# Altium schematic sheet ESIMA E-Meter_CPU.SchDoc: Esima CPU
size A3; DrawnBy: Jürgen Merz; Address1: Wilhelm- Schickard- Strasse 10; Address2: 78052 Villingen Schwenningen; Address3: juergen.merz@hsg-imit.de; Address4: Tel. +49 7721 943 138; PhoneNumber: +49 7721 943 138; FaxNumber: +49 7721 943 140
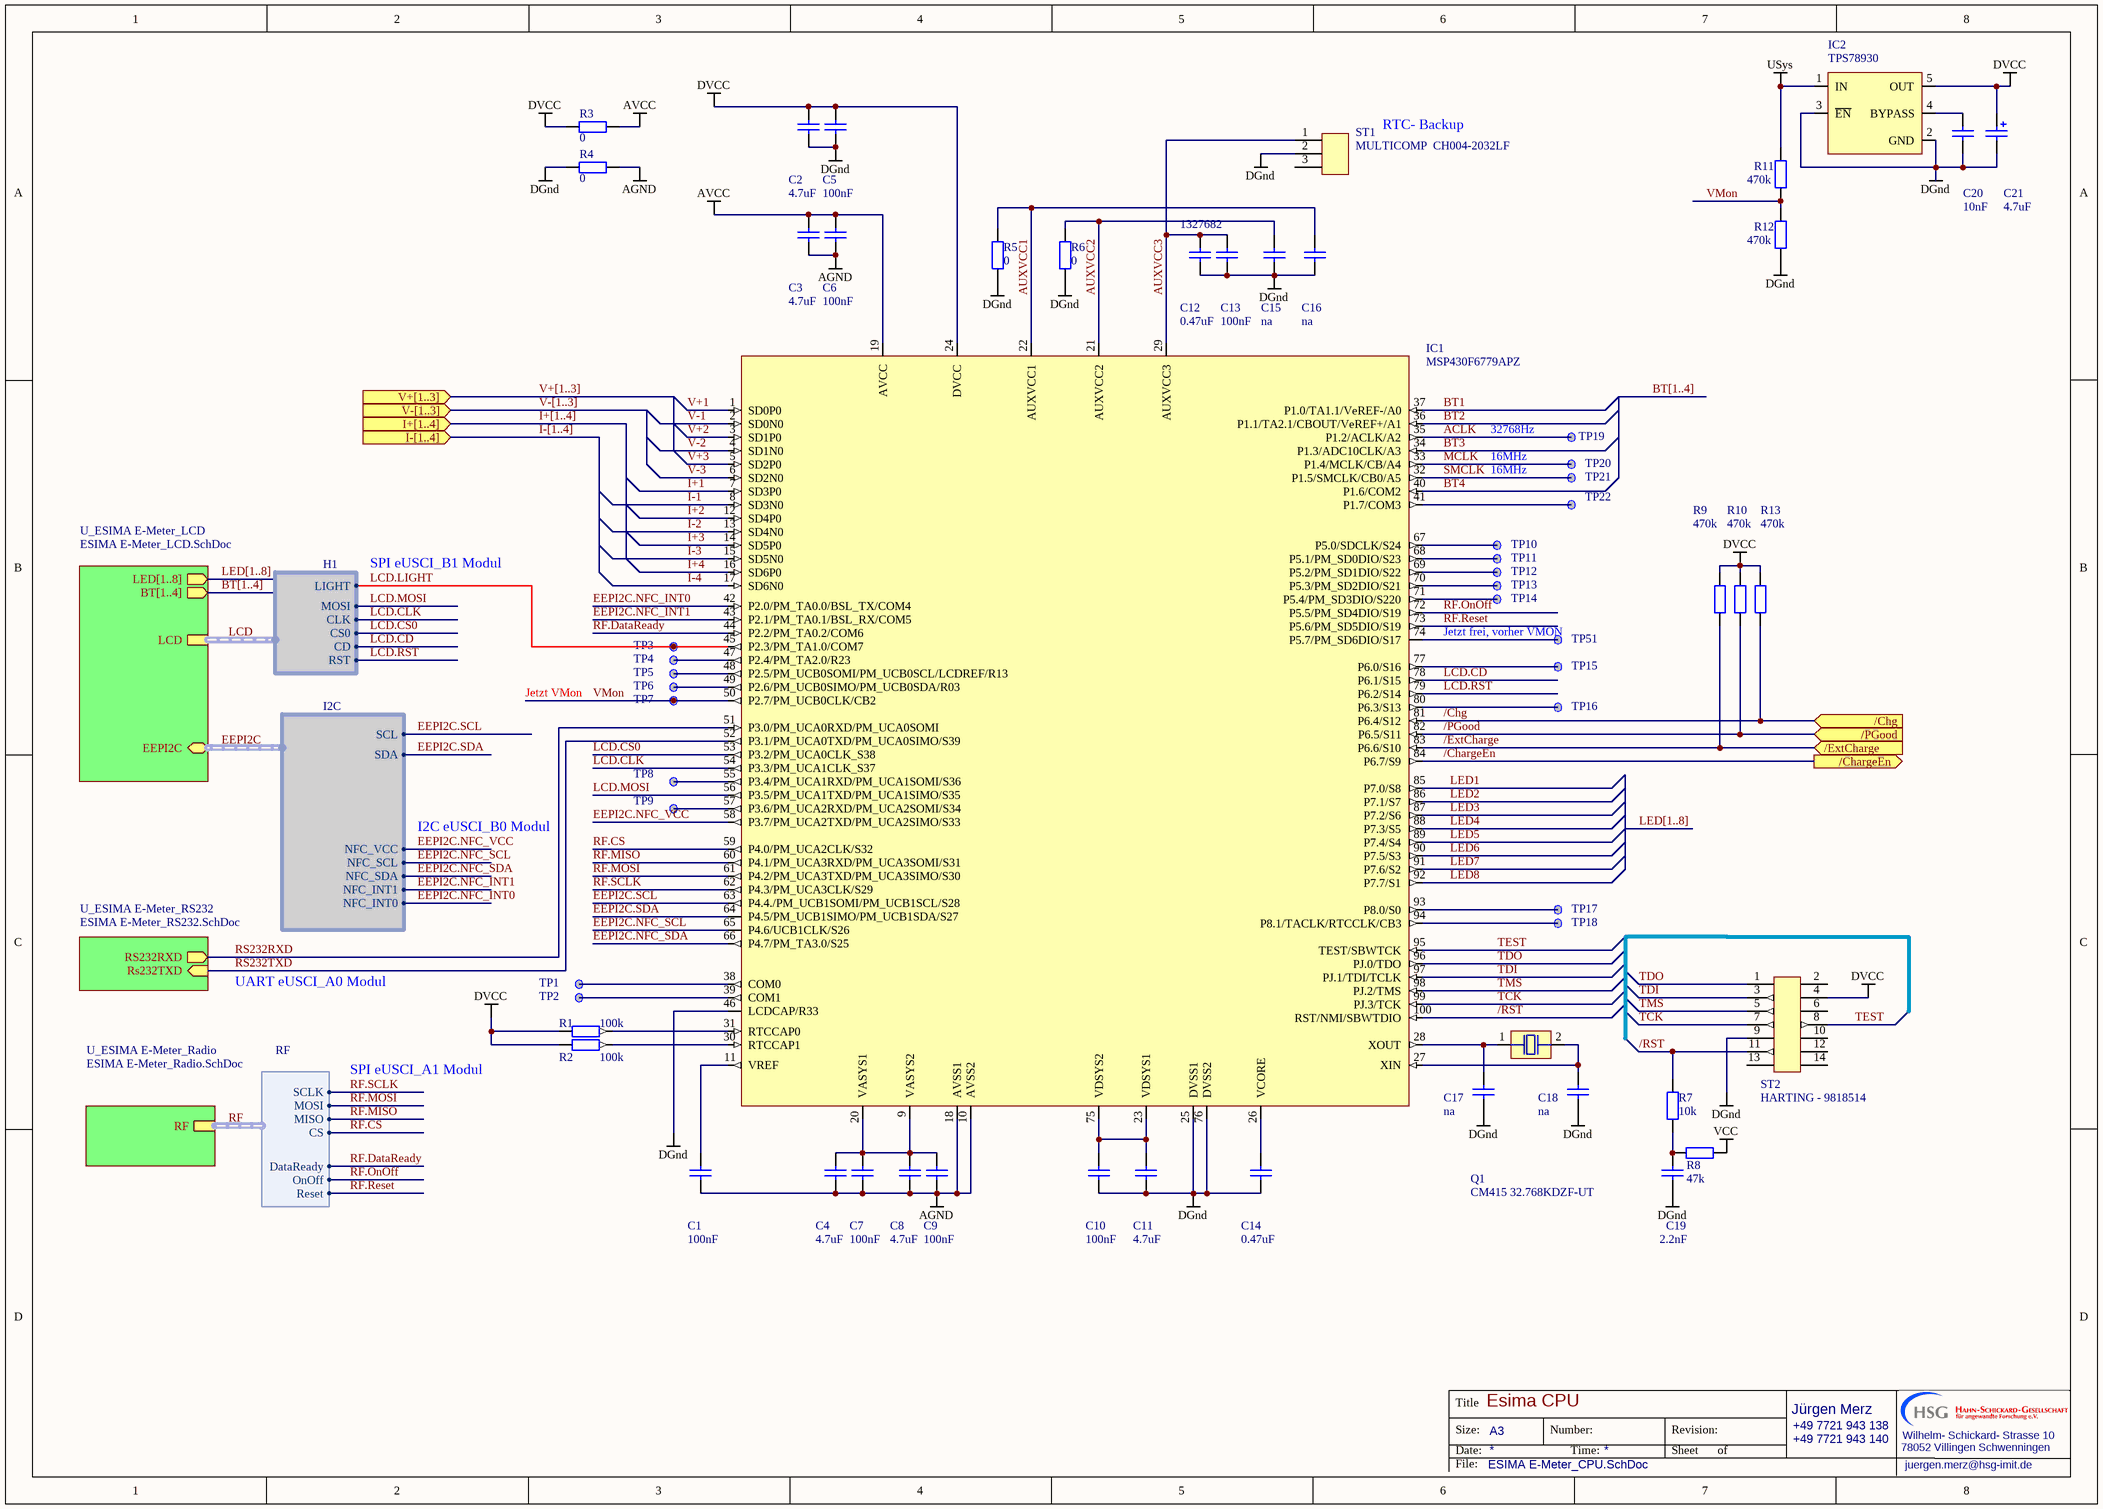
[diagram p0: ESIMA E-Meter_CPU.SchDoc]

## Parts
C1  100nF  [CAPC1608N]
C2  4.7uF  [CAPC1608N]
C3  4.7uF  [CAPC1608N]
C4  4.7uF  [CAPC1608N]
C5  100nF  [CAPC1608N]
C6  100nF  [CAPC1608N]
C7  100nF  [CAPC1608N]
C8  4.7uF  [CAPC1608N]
C9  100nF  [CAPC1608N]
C10  100nF  [CAPC1608N]
C11  4.7uF  [CAPC1608N]
C12  0.47uF  Supplier Part Number 1: 1327682  [CAPC1608N]
C13  100nF  [CAPC1608N]
C14  0.47uF  [CAPC1608N]
C15  na  [CAPC1608N]
C16  na  [CAPC1608N]
C17  na  [CAPC1608N]
C18  na  [CAPC1608N]
C19  2.2nF  [CAPC1608N]
C20  10nF  [CAPC1608N]
C21  4.7uF  [Cap Tant Pol Form B]
IC1  MSP430F6779APZ  [TI-PZ100_N]
IC2  TPS78930  [TI-DBV5 (SOT23-5)]
Q1  CM415 32.768KDZF-UT  [Quarz 2 Pin 4.1mm * 1.5mm]
R1  100k  [RESC1608N]
R2  100k  [RESC1608N]
R3  0  [RESC2012N]
R4  0  [RESC2012N]
R5  0  [RESC1608N]
R6  0  [RESC1608N]
R7  10k  [RESC1608N]
R8  47k  [RESC1608N]
R9  470k  [RESC1608N]
R10  470k  [RESC1608N]
R11  470k  [RESC1608N]
R12  470k  [RESC1608N]
R13  470k  [RESC1608N]
ST1  MULTICOMP  CH004-2032LF  [MULTICOMP  CH004-2032LF]
ST2  HARTING - 9818514  [HARTING -09 18 514 7324]
TP1  Testpoint 1mm  [Testpoint 1mm]  (value not drawn)  (no BOM)
TP2  Testpoint 1mm  [Testpoint 1mm]  (value not drawn)  (no BOM)
TP3  Testpoint 1mm  [Testpoint 1mm]  (value not drawn)  (no BOM)
TP4  Testpoint 1mm  [Testpoint 1mm]  (value not drawn)  (no BOM)
TP5  Testpoint 1mm  [Testpoint 1mm]  (value not drawn)  (no BOM)
TP6  Testpoint 1mm  [Testpoint 1mm]  (value not drawn)  (no BOM)
TP7  Testpoint 1mm  [Testpoint 1mm]  (value not drawn)  (no BOM)
TP8  Testpoint 1mm  [Testpoint 1mm]  (value not drawn)  (no BOM)
TP9  Testpoint 1mm  [Testpoint 1mm]  (value not drawn)  (no BOM)
TP10  Testpoint 1mm  [Testpoint 1mm]  (value not drawn)  (no BOM)
TP11  Testpoint 1mm  [Testpoint 1mm]  (value not drawn)  (no BOM)
TP12  Testpoint 1mm  [Testpoint 1mm]  (value not drawn)  (no BOM)
TP13  Testpoint 1mm  [Testpoint 1mm]  (value not drawn)  (no BOM)
TP14  Testpoint 1mm  [Testpoint 1mm]  (value not drawn)  (no BOM)
TP15  Testpoint 1mm  [Testpoint 1mm]  (value not drawn)  (no BOM)
TP16  Testpoint 1mm  [Testpoint 1mm]  (value not drawn)  (no BOM)
TP17  Testpoint 1mm  [Testpoint 1mm]  (value not drawn)  (no BOM)
TP18  Testpoint 1mm  [Testpoint 1mm]  (value not drawn)  (no BOM)
TP19  Testpoint 1mm  [Testpoint 1mm]  (value not drawn)  (no BOM)
TP20  Testpoint 1mm  [Testpoint 1mm]  (value not drawn)  (no BOM)
TP21  Testpoint 1mm  [Testpoint 1mm]  (value not drawn)  (no BOM)
TP22  Testpoint 1mm  [Testpoint 1mm]  (value not drawn)  (no BOM)
TP51  Testpoint 1mm  [Testpoint 1mm]  (value not drawn)  (no BOM)

## Sub-sheets
U_ESIMA E-Meter_LCD = ESIMA E-Meter_LCD.SchDoc: LED[1..8] (out), BT[1..4] (out, harness H_LCD), LCD (harness H1), EEPI2C (harness I2C)
U_ESIMA E-Meter_Radio = ESIMA E-Meter_Radio.SchDoc: RF (harness RF)
U_ESIMA E-Meter_RS232 = ESIMA E-Meter_RS232.SchDoc: Rs232TXD (in), RS232RXD (out)

## Ports
/ChargeEn (out), /Chg (in), /ExtCharge (in), /PGood (in), I+[1..4] (in), I-[1..4] (in), V+[1..3] (in), V-[1..3] (in)

## Harnesses
RF: SCLK, MOSI, MISO, CS, DataReady, OnOff, Reset
I2C: SCL, SDA, NFC_INT1, NFC_INT0, NFC_VCC, NFC_SCL, NFC_SDA
H1: CS0, MOSI, CLK, CD, RST, LIGHT

## Nets
AGND: C1.1 C3.1 C4.1 C6.1 C7.1 C8.1 C9.1 IC1.10(AVSS2) IC1.18(AVSS1) R4.1
AVCC: C3.2 C6.2 IC1.19(AVCC) R3.1
DGnd: C2.1 C5.1 C10.1 C11.1 C12.1 C13.1 C14.1 C15.1 C16.1 C17.1 C18.1 C19.1 C20.1 C21.2 IC1.25(DVSS1) IC1.46(LCDCAP/R33) IC1.76(DVSS2) IC2.2(GND) IC2.3(~{EN}) R4.2 R5.1 R6.1 R12.1 ST1.2 ST2.9
DVCC: C2.2 C5.2 C21.1 IC1.24(DVCC) IC2.5(OUT) R1.2 R2.2 R3.2 R9.1 R10.1 R13.1 ST2.4
USys: IC2.1(IN) R11.2
VCC: R8.1
/ChargeEn: IC1.84(P6.7/S9) ; port /ChargeEn
/Chg: IC1.81(P6.4/S12) R13.2 ; port /Chg
/ExtCharge: IC1.83(P6.6/S10) R9.2 ; port /ExtCharge
/PGood: IC1.82(P6.5/S11) R10.2 ; port /PGood
/RST: IC1.100(RST/NMI/SBWTDIO) R7.1 ST2.11
ACLK: IC1.35(P1.2/ACLK/A2) TP19.1
AUXVCC1: C16.2 IC1.22(AUXVCC1) R5.2
AUXVCC2: C15.2 IC1.21(AUXVCC2) R6.2
AUXVCC3: C12.2 C13.2 IC1.29(AUXVCC3) ST1.1
BT1: IC1.37(P1.0/TA1.1/VeREF-/A0)
BT2: IC1.36(P1.1/TA2.1/CBOUT/VeREF+/A1)
BT3: IC1.34(P1.3/ADC10CLK/A3)
BT4: IC1.40(P1.6/COM2)
EEPI2C.NFC_INT0: IC1.42(P2.0/PM_TA0.0/BSL_TX/COM4) ; sheet U_ESIMA E-Meter_LCD/EEPI2C.NFC_INT0
EEPI2C.NFC_INT1: IC1.43(P2.1/PM_TA0.1/BSL_RX/COM5) ; sheet U_ESIMA E-Meter_LCD/EEPI2C.NFC_INT1
EEPI2C.NFC_SCL: IC1.65(P4.6/UCB1CLK/S26) ; sheet U_ESIMA E-Meter_LCD/EEPI2C.NFC_SCL
EEPI2C.NFC_SDA: IC1.66(P4.7/PM_TA3.0/S25) ; sheet U_ESIMA E-Meter_LCD/EEPI2C.NFC_SDA
EEPI2C.NFC_VCC: IC1.58(P3.7/PM_UCA2TXD/PM_UCA2SIMO/S33) ; sheet U_ESIMA E-Meter_LCD/EEPI2C.NFC_VCC
EEPI2C.SCL: IC1.63(P4.4./PM_UCB1SOMI/PM_UCB1SCL/S28) ; sheet U_ESIMA E-Meter_LCD/EEPI2C.SCL
EEPI2C.SDA: IC1.64(P4.5/PM_UCB1SIMO/PM_UCB1SDA/S27) ; sheet U_ESIMA E-Meter_LCD/EEPI2C.SDA
I+1: IC1.7(SD3P0)
I+2: IC1.12(SD4P0)
I+3: IC1.14(SD5P0)
I+4: IC1.16(SD6P0)
I-1: IC1.8(SD3N0)
I-2: IC1.13(SD4N0)
I-3: IC1.15(SD5N0)
I-4: IC1.17(SD6N0)
LCD.CD: IC1.78(P6.1/S15) ; sheet U_ESIMA E-Meter_LCD/LCD.CD
LCD.CLK: IC1.54(P3.3/PM_UCA1CLK_S37) ; sheet U_ESIMA E-Meter_LCD/LCD.CLK
LCD.CS0: IC1.53(P3.2/PM_UCA0CLK_S38) ; sheet U_ESIMA E-Meter_LCD/LCD.CS0
LCD.LIGHT: IC1.45(P2.3/PM_TA1.0/COM7) TP3.1 ; sheet U_ESIMA E-Meter_LCD/LCD.LIGHT
LCD.MOSI: IC1.56(P3.5/PM_UCA1TXD/PM_UCA1SIMO/S35) ; sheet U_ESIMA E-Meter_LCD/LCD.MOSI
LCD.RST: IC1.79(P6.2/S14) ; sheet U_ESIMA E-Meter_LCD/LCD.RST
LED1: IC1.85(P7.0/S8)
LED2: IC1.86(P7.1/S7)
LED3: IC1.87(P7.2/S6)
LED4: IC1.88(P7.3/S5)
LED5: IC1.89(P7.4/S4)
LED6: IC1.90(P7.5/S3)
LED7: IC1.91(P7.6/S2)
LED8: IC1.92(P7.7/S1)
MCLK: IC1.33(P1.4/MCLK/CB/A4) TP20.1
RF.CS: IC1.59(P4.0/PM_UCA2CLK/S32) ; sheet U_ESIMA E-Meter_Radio/RF.CS
RF.DataReady: IC1.44(P2.2/PM_TA0.2/COM6) ; sheet U_ESIMA E-Meter_Radio/RF.DataReady
RF.MISO: IC1.60(P4.1/PM_UCA3RXD/PM_UCA3SOMI/S31) ; sheet U_ESIMA E-Meter_Radio/RF.MISO
RF.MOSI: IC1.61(P4.2/PM_UCA3TXD/PM_UCA3SIMO/S30) ; sheet U_ESIMA E-Meter_Radio/RF.MOSI
RF.OnOff: IC1.72(P5.5/PM_SD4DIO/S19) ; sheet U_ESIMA E-Meter_Radio/RF.OnOff
RF.Reset: IC1.73(P5.6/PM_SD5DIO/S19) ; sheet U_ESIMA E-Meter_Radio/RF.Reset
RF.SCLK: IC1.62(P4.3/PM_UCA3CLK/S29) ; sheet U_ESIMA E-Meter_Radio/RF.SCLK
RS232RXD: IC1.51(P3.0/PM_UCA0RXD/PM_UCA0SOMI) ; sheet U_ESIMA E-Meter_RS232/RS232RXD
RS232TXD: IC1.52(P3.1/PM_UCA0TXD/PM_UCA0SIMO/S39) ; sheet U_ESIMA E-Meter_RS232/Rs232TXD
SMCLK: IC1.32(P1.5/SMCLK/CB0/A5) TP21.1
TCK: IC1.99(PJ.3/TCK) ST2.7
TDI: IC1.97(PJ.1/TDI/TCLK) ST2.3
TDO: IC1.96(PJ.0/TDO) ST2.1
TEST: IC1.95(TEST/SBWTCK) ST2.8
TMS: IC1.98(PJ.2/TMS) ST2.5
V+1: IC1.1(SD0P0)
V+2: IC1.3(SD1P0)
V+3: IC1.5(SD2P0)
V-1: IC1.2(SD0N0)
V-2: IC1.4(SD1N0)
V-3: IC1.6(SD2N0)
VMon: IC1.50(P2.7/PM_UCB0CLK/CB2) R11.1 R12.2 TP7.1
NetC1_2: C1.2 IC1.11(VREF)
NetC4_2: C4.2 C7.2 C8.2 C9.2 IC1.9(VASYS2) IC1.20(VASYS1)
NetC10_2: C10.2 C11.2 IC1.23(VDSYS1) IC1.75(VDSYS2)
NetC14_2: C14.2 IC1.26(VCORE)
NetC17_2: C17.2 IC1.28(XOUT) Q1.1(In)
NetC18_2: C18.2 IC1.27(XIN) Q1.2(Out)
NetC19_2: C19.2 R7.2 R8.2
NetC20_2: C20.2 IC2.4(BYPASS)
NetIC1_30: IC1.30(RTCCAP1) R2.1
NetIC1_31: IC1.31(RTCCAP0) R1.1
NetIC1_38: IC1.38(COM0) TP1.1
NetIC1_39: IC1.39(COM1) TP2.1
NetIC1_41: IC1.41(P1.7/COM3) TP22.1
NetIC1_47: IC1.47(P2.4/PM_TA2.0/R23) TP4.1
NetIC1_48: IC1.48(P2.5/PM_UCB0SOMI/PM_UCB0SCL/LCDREF/R13) TP5.1
NetIC1_49: IC1.49(P2.6/PM_UCB0SIMO/PM_UCB0SDA/R03) TP6.1
NetIC1_55: IC1.55(P3.4/PM_UCA1RXD/PM_UCA1SOMI/S36) TP8.1
NetIC1_57: IC1.57(P3.6/PM_UCA2RXD/PM_UCA2SOMI/S34) TP9.1
NetIC1_67: IC1.67(P5.0/SDCLK/S24) TP10.1
NetIC1_68: IC1.68(P5.1/PM_SD0DIO/S23) TP11.1
NetIC1_69: IC1.69(P5.2/PM_SD1DIO/S22) TP12.1
NetIC1_70: IC1.70(P5.3/PM_SD2DIO/S21) TP13.1
NetIC1_71: IC1.71(P5.4/PM_SD3DIO/S220) TP14.1
NetIC1_74: IC1.74(P5.7/PM_SD6DIO/S17) TP51.1
NetIC1_77: IC1.77(P6.0/S16) TP15.1
NetIC1_80: IC1.80(P6.3/S13) TP16.1
NetIC1_93: IC1.93(P8.0/S0) TP17.1
NetIC1_94: IC1.94(P8.1/TACLK/RTCCLK/CB3) TP18.1

Not connected (* = marked no-connect by the designer): ST1 3; ST2 2 6 10 12 13 14

## Buses and harness runs
bus BT[1..4]
bus I+[1..4] = port I+[1..4]
bus I-[1..4] = port I-[1..4]
bus LED[1..8]
bus LED[1..8] = sheet U_ESIMA E-Meter_LCD/LED[1..8]
bus V+[1..3] = port V+[1..3]
bus V-[1..3] = port V-[1..3]
harness EEPI2C = sheet U_ESIMA E-Meter_LCD/EEPI2C
harness LCD = sheet U_ESIMA E-Meter_LCD/LCD
harness RF = sheet U_ESIMA E-Meter_Radio/RF

## Notes on the sheet
- RTC- Backup
- 32768Hz
- 16MHz
- SPI eUSCI_B1 Modul
- (near TP51) Jetzt frei, vorher VMON
- Jetzt VMon
- I2C eUSCI_B0 Modul
- UART eUSCI_A0 Modul
- SPI eUSCI_A1 Modul
- Title
- Size:
- Date:
- A3
- Number:
- Time:
- Revision:
- Sheet
- of
- File:

## Library data of the parts
C1-C20 = CAPC1608 (C0603)
  C1 C5-C7 C9 C10 C13: Supplier 1: Farnell; Supplier Part Number 1: 1657913
  C2-C4 C8 C11: Supplier 1: Farnell; Supplier Part Number 1: 1740638RL
  C12: Supplier 1: Farnell
  C14: Supplier 1: Farnell; Supplier Part Number 1: 1327682
  C19: Supplier 1: Farnell; Supplier Part Number 1: 1657921
  C20: Supplier 1: Farnell; Supplier Part Number 1: 1657919
C21 = Cap Tant Pol Form B: Supplier 1: Farnell; Supplier Part Number 1: 2353051
IC1 = MSP430F6779AIPZ: Mikroprozessor 16bit Polyphase Metering; Supplier 1: Mouser; Supplier Part Number 1: 595-MSP430F6779IPZ
IC2 = TPS78930: Voltageregulator low Current; Supplier 1: Farnell; Supplier Part Number 1: 8461732
Q1 = Quarz 2 Pin 4.1mm * 1.5mm: Supplier 1: Mouser; Supplier Part Number 1: 695-CM41532.768KDZF
R1 R2 R5-R13 = RESC1608 (R0603)
  R1 R2: Supplier 1: Farnell; Supplier Part Number 1: 1576310
  R5 R6: Supplier 1: Farnell; Supplier Part Number 1: 2008343
  R7: Supplier 1: Farnell; Supplier Part Number 1: 2008341
  R8: Supplier 1: Farnell; Supplier Part Number 1: 2333548
  R9 R10 R13: Supplier 1: Farnell; Supplier Part Number 1: 2333613
R3 R4 = RESC2012N (R0805): Supplier 1: Farnell; Supplier Part Number 1: 9333681
ST1 = Stecker 3Pol universal: Supplier 1: Farnell; Supplier Part Number 1: 2064723
ST2 = HARTING - 9818514: Messerleiste Gerade 14Pol; Supplier 1: Farnell; Supplier Part Number 1: 1096986
TP1-TP22 TP51 = Tespoint 1mm